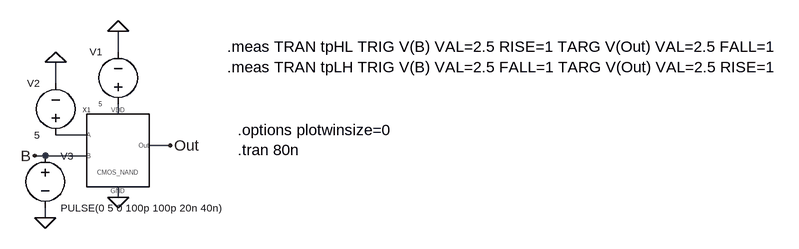
[diagram p0: schematic cmos_nand_test.asc]
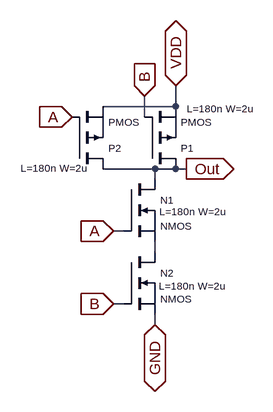
[diagram p1: sub-circuit cmos_nand_2input.asc]
cmos_nand_test.asc, the LTspice schematic file:
Version 4.1
SHEET 1 1272 680
WIRE 192 0 192 -32
WIRE 96 48 96 16
WIRE 192 96 192 80
WIRE 144 128 96 128
WIRE 272 144 240 144
WIRE 80 160 64 160
WIRE 144 160 80 160
WIRE 192 224 192 208
WIRE 80 256 80 240
FLAG 192 -32 0
FLAG 96 16 0
FLAG 80 256 0
FLAG 192 224 0
FLAG 64 160 B
FLAG 272 144 Out
SYMBOL CMOS_NAND_2input 192 144 R0
SYMATTR InstName X1
SYMBOL voltage 192 96 R180
WINDOW 0 24 96 Left 1
WINDOW 3 24 16 Left 0
WINDOW 123 0 0 Left 0
WINDOW 39 0 0 Left 0
SYMATTR InstName V1
SYMATTR Value 5
SYMBOL voltage 96 144 R180
WINDOW 0 24 96 Left 1
WINDOW 3 24 16 Left 1
WINDOW 123 0 0 Left 0
WINDOW 39 0 0 Left 0
SYMATTR InstName V2
SYMATTR Value 5
SYMBOL voltage 80 144 R0
WINDOW 0 24 16 Left 1
WINDOW 3 24 96 Left 1
WINDOW 123 0 0 Left 0
WINDOW 39 0 0 Left 0
SYMATTR InstName V3
SYMATTR Value PULSE(0 5 0 100p 100p 20n 40n)
TEXT 360 -8 Left 2 !.meas TRAN tpHL TRIG V(B) VAL=2.5 RISE=1 TARG V(Out) VAL=2.5 FALL=1\n.meas TRAN tpLH TRIG V(B) VAL=2.5 FALL=1 TARG V(Out) VAL=2.5 RISE=1
TEXT 376 120 Left 2 !.options plotwinsize=0\n.tran 80n

cmos_nand_2input.asc, the sub-circuit schematic file:
Version 4.1
SHEET 1 880 680
WIRE 144 -192 144 -224
WIRE 144 -192 32 -192
WIRE 96 -176 96 -208
WIRE 112 -96 32 -96
WIRE 144 -96 112 -96
WIRE 160 -96 144 -96
WIRE 112 -80 112 -96
WIRE 64 0 48 0
WIRE 112 32 112 16
WIRE 64 112 48 112
WIRE 112 144 112 128
FLAG -16 -176 A
IOPIN -16 -176 In
FLAG 96 -208 B
IOPIN 96 -208 In
FLAG 144 -224 VDD
IOPIN 144 -224 BiDir
FLAG 112 144 GND
IOPIN 112 144 BiDir
FLAG 48 0 A
IOPIN 48 0 In
FLAG 48 112 B
IOPIN 48 112 In
FLAG 160 -96 Out
IOPIN 160 -96 Out
SYMBOL pmos 96 -96 M180
WINDOW 0 56 32 Left 1
WINDOW 3 56 72 Left 1
WINDOW 123 65 93 Left 1
SYMATTR InstName P1
SYMATTR Value2 L=180n W=2u
SYMBOL pmos -16 -96 M180
WINDOW 0 56 32 Left 1
WINDOW 3 56 72 Left 1
WINDOW 123 -79 1 Left 1
SYMATTR InstName P2
SYMATTR Value2 L=180n W=2u
SYMBOL nmos 64 -80 R0
WINDOW 0 56 32 Left 1
WINDOW 3 56 72 Left 1
WINDOW 123 55 50 Left 1
SYMATTR InstName N1
SYMATTR Value2 L=180n W=2u
SYMBOL nmos 64 32 R0
WINDOW 0 56 32 Left 1
WINDOW 3 56 72 Left 1
WINDOW 123 54 52 Left 1
SYMATTR InstName N2
SYMATTR Value2 L=180n W=2u

The netlist it stands for:
* cmos_nand_test.asc
X§X1 N002 B 0 Out N001 cmos_nand_2input
V1 N001 0 5
V2 N002 0 5
V3 B 0 PULSE(0 5 0 100p 100p 20n 40n)

* block symbol definitions
.subckt cmos_nand_2input A B GND Out VDD
M§P1 Out B VDD VDD PMOS L=180n W=2u
M§P2 Out A VDD VDD PMOS L=180n W=2u
M§N1 Out A N001 N001 NMOS L=180n W=2u
M§N2 N001 B GND GND NMOS L=180n W=2u
.ends cmos_nand_2input

.model NMOS NMOS
.model PMOS PMOS
.lib standard.mos
.meas TRAN tpHL TRIG V(B) VAL=2.5 RISE=1 TARG V(Out) VAL=2.5 FALL=1
.meas TRAN tpLH TRIG V(B) VAL=2.5 FALL=1 TARG V(Out) VAL=2.5 RISE=1
.options plotwinsize=0
.tran 80n
.backanno
.end

* Results of the author's LTspice run, read from the files saved beside the schematic
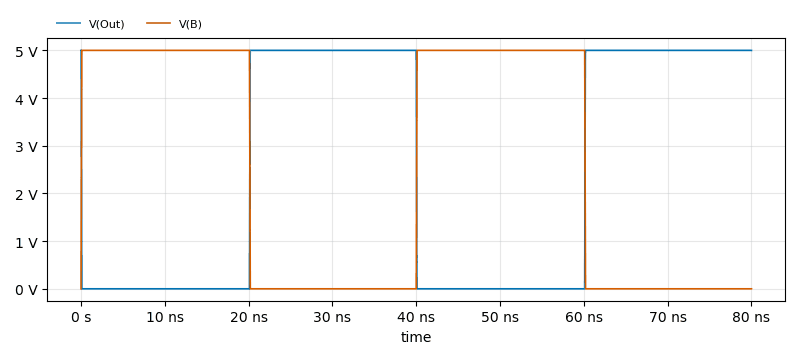
[diagram p2: Transient Analysis of cmos_nand_test.asc, plotted from the saved traces]
* Transient Analysis, 1 run:
*   V(Out): min 0 V, max 5 V, average 2.489 V, rms 3.527 V, last 5 V
*   V(B): min 0 V, max 5 V, average 2.512 V, rms 3.543 V, last 0 V
* From the log:
*   tphl=6.82898429261e-12 FROM 5.00000002402e-11 TO 5.68289845328e-11
*   tplh=-9.67970197403e-12 FROM 2.015e-08 TO 2.0140320298e-08